# EAGLE design BPM7005_Dual_Shield_MegaWing (EAGLE 5.11)
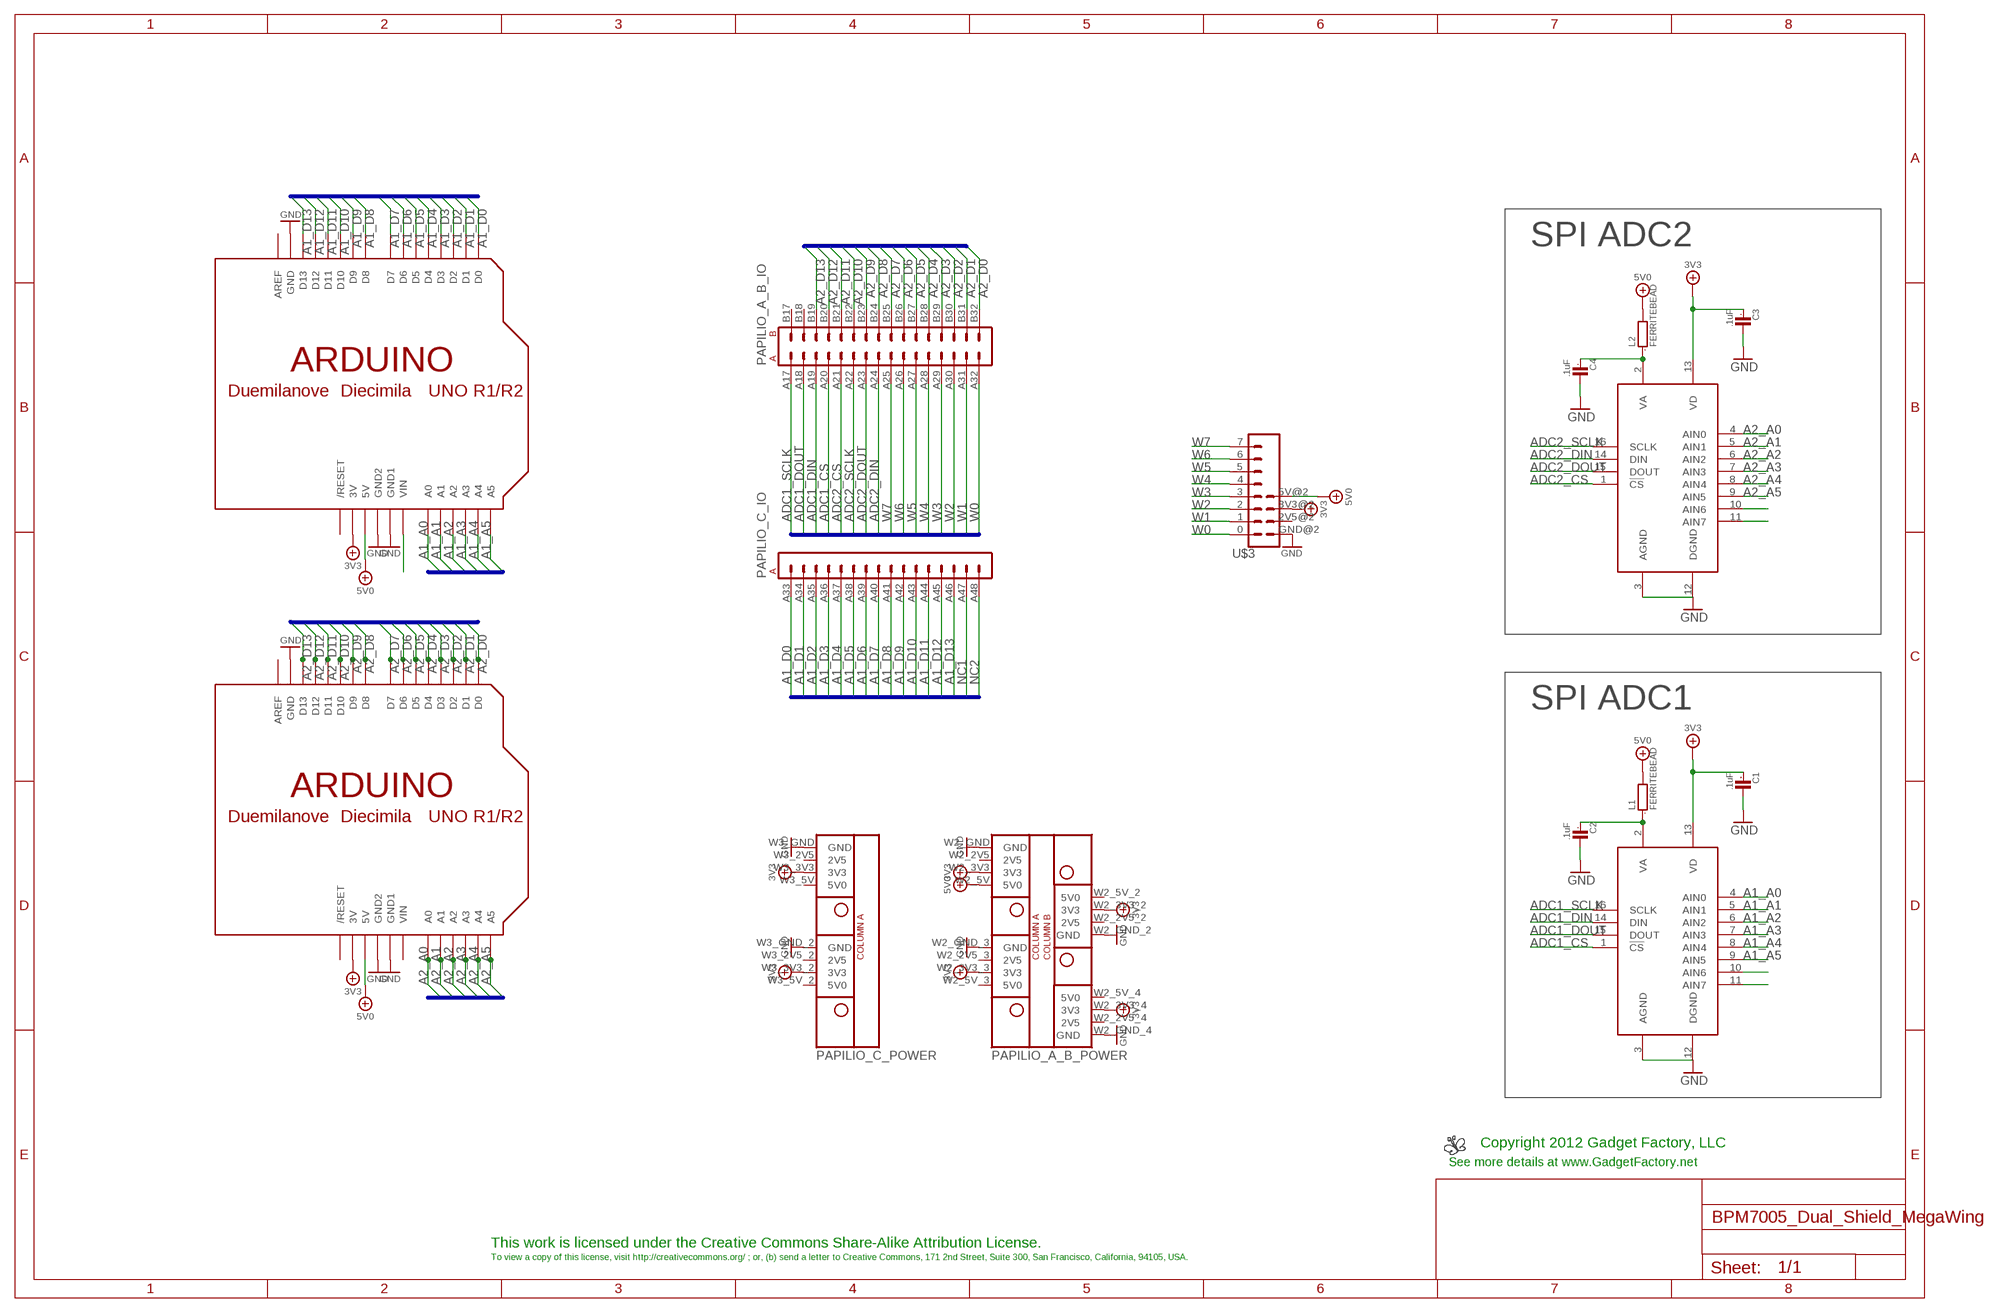
[diagram p0: schematic, sheet 1]

## Parts
ADC1  ADC088S102CIMT  [TSSOP16]
ADC2  ADC088S102CIMT  [TSSOP16]
C1  .1uF  C0603  [0603]
C2  .1uF  C0603  [0603]
C3  .1uF  C0603  [0603]
C4  .1uF  C0603  [0603]
L1  FERRITEBEAD  R0603  [0603]
L2  FERRITEBEAD  R0603  [0603]
LOGO1  BUTTERFLY_LOGO  [BUTTERFLY_LOGO]
PAPILIO_  MEGAWING_FULL_P1MEGAWING_P1  [MEGAWING_FULL_NOHOLES_P1]
U$1  ARDUINO-NOHOLE  [ARDUINO-NOHOLE]
U$2  ARDUINO-NOHOLE  [ARDUINO-NOHOLE]
U$3  WING8WING8_NOHOLES  [WINGSIDE_8BIT_NOHOLES]

## Nets
3V3: ADC1.13(VD) ADC2.13(VD) C1.1 C3.1 PAPILIO_.W2_3V3(A_B_POWER:3V3) PAPILIO_.W2_3V3_2(A_B_POWER:3V3) PAPILIO_.W2_3V3_3(A_B_POWER:3V3) PAPILIO_.W2_3V3_4(A_B_POWER:3V3) PAPILIO_.W3_3V3(C_POWER:3V3) PAPILIO_.W3_3V3_2(C_POWER:3V3) U$1.3V U$2.3V U$3.3V3@2(3V3)
5V0: L1.2 L2.2 PAPILIO_.W2_5V(A_B_POWER:5V0) U$1.5V U$2.5V U$3.5V@2(5V)
A1_A0: ADC1.4(AIN0) U$1.A0
A1_A1: ADC1.5(AIN1) U$1.A1
A1_A2: ADC1.6(AIN2) U$1.A2
A1_A3: ADC1.7(AIN3) U$1.A3
A1_A4: ADC1.8(AIN4) U$1.A4
A1_A5: ADC1.9(AIN5) U$1.A5
A1_D0: PAPILIO_.A33(C_IO:A1) U$1.D0
A1_D1: PAPILIO_.A34(C_IO:A2) U$1.D1
A1_D2: PAPILIO_.A35(C_IO:A3) U$1.D2
A1_D3: PAPILIO_.A36(C_IO:A4) U$1.D3
A1_D4: PAPILIO_.A37(C_IO:A5) U$1.D4
A1_D5: PAPILIO_.A38(C_IO:A6) U$1.D5
A1_D6: PAPILIO_.A39(C_IO:A7) U$1.D6
A1_D7: PAPILIO_.A40(C_IO:A8) U$1.D7
A1_D8: PAPILIO_.A41(C_IO:A9) U$1.D8
A1_D9: PAPILIO_.A42(C_IO:A10) U$1.D9
A1_D10: PAPILIO_.A43(C_IO:A11) U$1.D10
A1_D11: PAPILIO_.A44(C_IO:A12) U$1.D11
A1_D12: PAPILIO_.A45(C_IO:A13) U$1.D12
A1_D13: PAPILIO_.A46(C_IO:A14) U$1.D13
A2_A0: ADC2.4(AIN0) U$2.A0
A2_A1: ADC2.5(AIN1) U$2.A1
A2_A2: ADC2.6(AIN2) U$2.A2
A2_A3: ADC2.7(AIN3) U$2.A3
A2_A4: ADC2.8(AIN4) U$2.A4
A2_A5: ADC2.9(AIN5) U$2.A5
A2_D0: PAPILIO_.B32(A_B_IO:B16) U$2.D0
A2_D1: PAPILIO_.B31(A_B_IO:B15) U$2.D1
A2_D2: PAPILIO_.B30(A_B_IO:B14) U$2.D2
A2_D3: PAPILIO_.B29(A_B_IO:B13) U$2.D3
A2_D4: PAPILIO_.B28(A_B_IO:B12) U$2.D4
A2_D5: PAPILIO_.B27(A_B_IO:B11) U$2.D5
A2_D6: PAPILIO_.B26(A_B_IO:B10) U$2.D6
A2_D7: PAPILIO_.B25(A_B_IO:B9) U$2.D7
A2_D8: PAPILIO_.B24(A_B_IO:B8) U$2.D8
A2_D9: PAPILIO_.B23(A_B_IO:B7) U$2.D9
A2_D10: PAPILIO_.B22(A_B_IO:B6) U$2.D10
A2_D11: PAPILIO_.B21(A_B_IO:B5) U$2.D11
A2_D12: PAPILIO_.B20(A_B_IO:B4) U$2.D12
A2_D13: PAPILIO_.B19(A_B_IO:B3) U$2.D13
ADC1_CS: ADC1.1(!CS) PAPILIO_.A20(A_B_IO:A4)
ADC1_DIN: ADC1.14(DIN) PAPILIO_.A19(A_B_IO:A3)
ADC1_DOUT: ADC1.15(DOUT) PAPILIO_.A18(A_B_IO:A2)
ADC1_SCLK: ADC1.16(SCLK) PAPILIO_.A17(A_B_IO:A1)
ADC2_CS: ADC2.1(!CS) PAPILIO_.A21(A_B_IO:A5)
ADC2_DIN: ADC2.14(DIN) PAPILIO_.A24(A_B_IO:A8)
ADC2_DOUT: ADC2.15(DOUT) PAPILIO_.A23(A_B_IO:A7)
ADC2_SCLK: ADC2.16(SCLK) PAPILIO_.A22(A_B_IO:A6)
GND: ADC1.3(AGND) ADC1.12(DGND) ADC2.3(AGND) ADC2.12(DGND) C1.2 C2.2 C3.2 C4.2 PAPILIO_.W2_GND(A_B_POWER:GND) PAPILIO_.W2_GND_2(A_B_POWER:GND) PAPILIO_.W2_GND_3(A_B_POWER:GND) PAPILIO_.W2_GND_4(A_B_POWER:GND) PAPILIO_.W3_GND(C_POWER:GND) PAPILIO_.W3_GND_2(C_POWER:GND) U$1.GND U$1.GND1 U$1.GND2 U$2.GND U$2.GND1 U$2.GND2 U$3.GND@2(GND)
N$1: U$1.VIN
N$6: ADC2.2(VA) C4.1 L2.1
N$8: ADC2.11(AIN7)
N$9: ADC2.10(AIN6)
N$37: ADC1.2(VA) C2.1 L1.1
N$39: ADC1.11(AIN7)
N$40: ADC1.10(AIN6)
NC1: PAPILIO_.A47(C_IO:A15)
NC2: PAPILIO_.A48(C_IO:A16)
W0: PAPILIO_.A32(A_B_IO:A16) U$3.0
W1: PAPILIO_.A31(A_B_IO:A15) U$3.1
W2: PAPILIO_.A30(A_B_IO:A14) U$3.2
W3: PAPILIO_.A29(A_B_IO:A13) U$3.3
W4: PAPILIO_.A28(A_B_IO:A12) U$3.4
W5: PAPILIO_.A27(A_B_IO:A11) U$3.5
W6: PAPILIO_.A26(A_B_IO:A10) U$3.6
W7: PAPILIO_.A25(A_B_IO:A9) U$3.7
Unconnected: PAPILIO_.B17(A_B_IO:B1) PAPILIO_.B18(A_B_IO:B2) PAPILIO_.W2_2V5(A_B_POWER:2V5) PAPILIO_.W2_2V5_2(A_B_POWER:2V5) PAPILIO_.W2_2V5_3(A_B_POWER:2V5) PAPILIO_.W2_2V5_4(A_B_POWER:2V5) PAPILIO_.W2_5V_2(A_B_POWER:5V0) PAPILIO_.W2_5V_3(A_B_POWER:5V0) PAPILIO_.W2_5V_4(A_B_POWER:5V0) PAPILIO_.W3_2V5(C_POWER:2V5) PAPILIO_.W3_2V5_2(C_POWER:2V5) PAPILIO_.W3_5V(C_POWER:5V0) PAPILIO_.W3_5V_2(C_POWER:5V0) U$1.AREF U$1.RESET(/RESET) U$2.AREF U$2.RESET(/RESET) U$3.2V5@2(2V5)

## Buses
SW[0..7],LED[0..7]
RED[0..2],GREEN[0..2],BLUE[0..1],VERTICAL_SYNC,HORIZONTAL_SYNC,AUDIO,SPI_SCLK,SPI_DIN,SPI_DOUT,SPI_CS,JOY_SELECT,JOY_RIGHT,JOY_LEFT,JOY_DOWN,JOY_UP,AN[0..3],A,B,C,D,E,F,G,DP
A1_D[0..13]
A1_A[0..7]
A2_D[0..13]
A2_A[0..7]

## Notes on the sheet
- SPI ADC2
- SPI ADC1
- Copyright 2012 Gadget Factory, LLC
- See more details at www.GadgetFactory.net
- This work is licensed under the Creative Commons Share-Alike Attribution License.
- To view a copy of this license, visit http://creativecommons.org/ ; or, (b) send a letter to Creative Commons, 171 2nd Street, Suite 300, San Francisco, California, 94105, USA.

## Power pins joined to a net without a drawn wire
VIN: U$2.VIN

## Library data of the parts
ADC1 ADC2 = spiadc:ADC088S102
C1-C4 = GadgetFactory:C: CAPACITOR, European symbol
L1 L2 = GadgetFactory:R: RESISTOR, European symbol
LOGO1 = GadgetFactory_Pub:BUTTERFLY_LOGO
PAPILIO_ = Papilio:MEGAWING_FULL_P1
U$1 U$2 = adafruit:ARDUINO: Arduino Diecimila/Duemilanove Make a shield with ease, this package has all the named pins as well as the two mounting drill holes and an outline of the USB and DC power connector. The outline is on the DIMENSION layer, so if your board house uses it they will cut the outline to match. http://www.ladyada.net/library/pcb/eaglelibrary.html
U$3 = Papilio:WING8

## Board
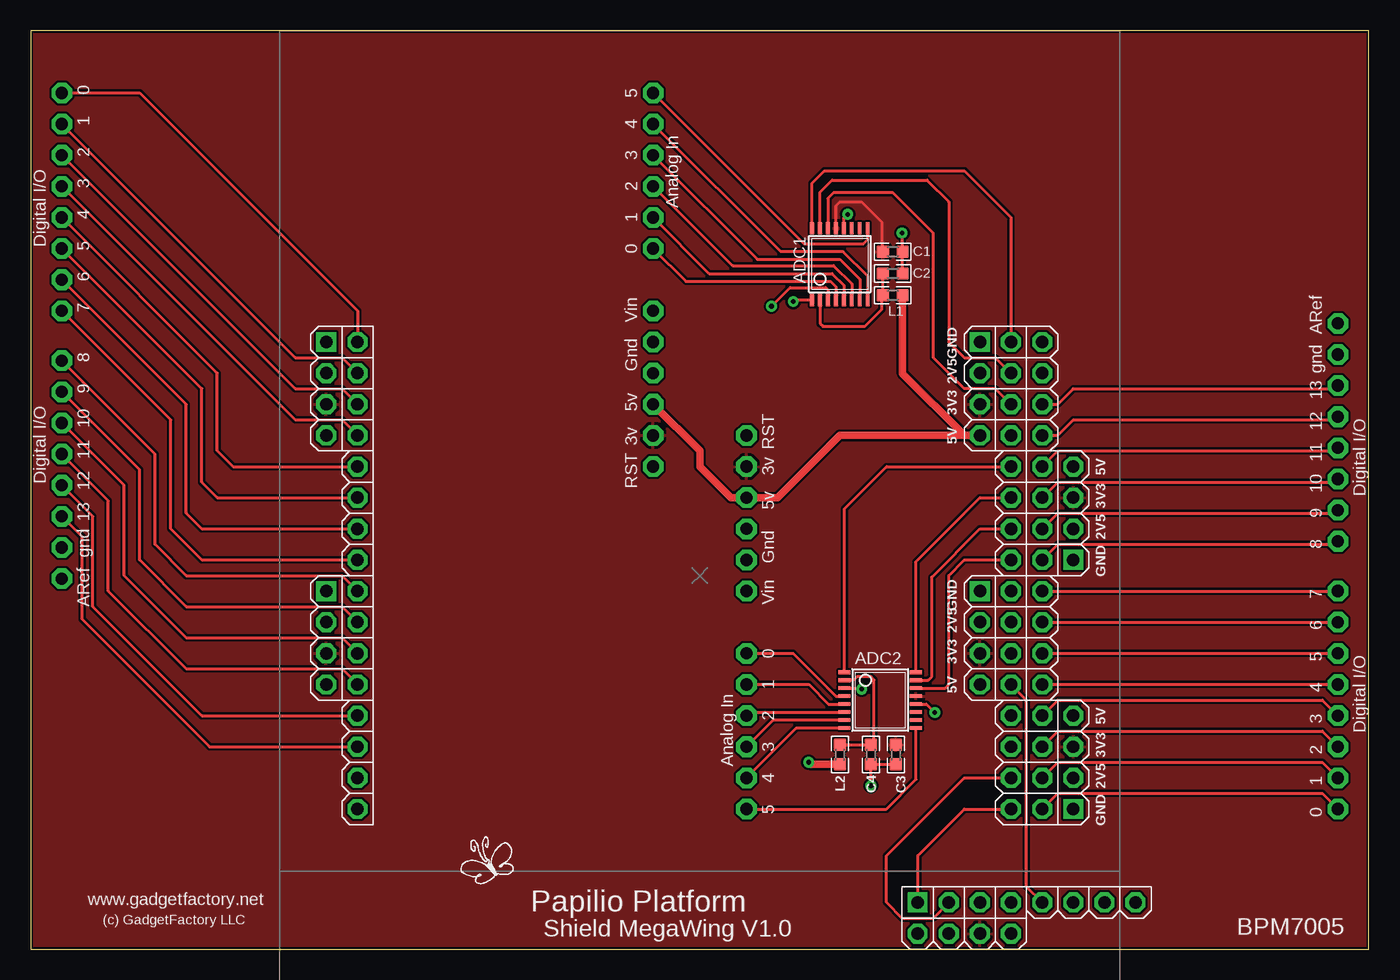
[diagram p1: board, top side]
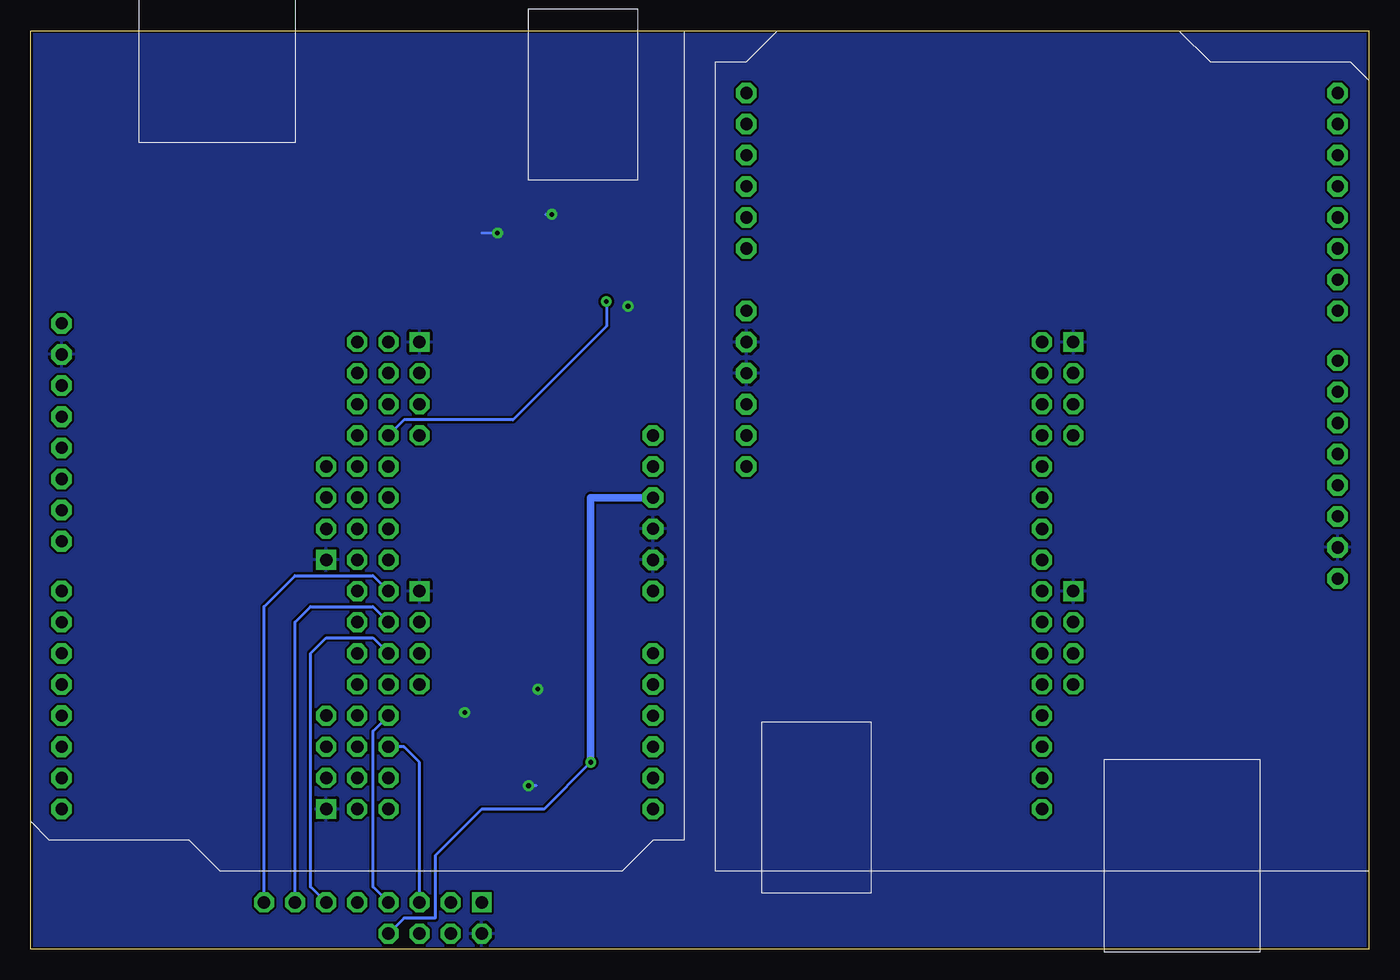
[diagram p2: board, bottom side, seen from below]

Size 109.21 x 74.93 mm. Coordinates in mm from the lower left corner, seen from the top.
Outline: 0,74.93 0,0 109.21,0 109.21,74.93 0,74.93
Copper layers (1*16): Top 0.035mm / dielectric 1.5mm / Bottom 0.035mm
Design rules "SparkFun_Derived_GoldePheonix_7mil *": minimum track width 7mil, minimum drill 15mil, track to track 7mil, track to pad 7mil, pad to pad 7mil, via to via 7mil, smd to smd 7mil, copper to edge 7mil, drill to drill 7mil, minimum pad ring 12mil, minimum via ring 10mil, stop-mask expansion 4mil, vias tented up to drill 18mil, thermal gap 10mil

### Footprints (pad centres in the part's own frame; a part is rotated, then mirrored left to right if it is on the bottom)
TSSOP16 = smd 0.305 x 0.991: 1 -2.275,-2.918; 2 -1.625,-2.918; 3 -0.975,-2.918; 4 -0.325,-2.918; 5 0.325,-2.918; 6 0.975,-2.918; 7 1.625,-2.918; 8 2.275,-2.918; 9 2.275,2.918; 10 1.625,2.918; 11 0.975,2.918; 12 0.325,2.918; 13 -0.325,2.918; 14 -0.975,2.918; 15 -1.625,2.918; 16 -2.275,2.918
0603 = smd 1 x 1: 1 -0.8,0; 2 0.8,0
MEGAWING_FULL_NOHOLES_P1 = drill 1.016 octagon: A17 59.69,43.18; A18 59.69,40.64; A19 59.69,38.1; A20 59.69,35.56; A21 59.69,33.02; A22 59.69,30.48; A23 59.69,27.94; A24 59.69,25.4; A25 59.69,22.86; A26 59.69,20.32; A27 59.69,17.78; A28 59.69,15.24; A29 59.69,12.7; A30 59.69,10.16; A31 59.69,7.62; A32 59.69,5.08; A33 6.35,43.18; A34 6.35,40.64; A35 6.35,38.1; A36 6.35,35.56; A37 6.35,33.02; A38 6.35,30.48; A39 6.35,27.94; A40 6.35,25.4; A41 6.35,22.86; A42 6.35,20.32; A43 6.35,17.78; A44 6.35,15.24; A45 6.35,12.7; A46 6.35,10.16; A47 6.35,7.62; A48 6.35,5.08; B17 62.23,43.18; B18 62.23,40.64; B19 62.23,38.1; B20 62.23,35.56; B21 62.23,33.02; B22 62.23,30.48; B23 62.23,27.94; B24 62.23,25.4; B25 62.23,22.86; B26 62.23,20.32; B27 62.23,17.78; B28 62.23,15.24; B29 62.23,12.7; B30 62.23,10.16; B31 62.23,7.62; B32 62.23,5.08; W2_2V5 57.15,40.64; W2_2V5_2 64.77,27.94; W2_2V5_3 57.15,20.32; W2_2V5_4 64.77,7.62; W2_3V3 57.15,38.1; W2_3V3_2 64.77,30.48; W2_3V3_3 57.15,17.78; W2_3V3_4 64.77,10.16; W2_5V 57.15,35.56; W2_5V_2 64.77,33.02; W2_5V_3 57.15,15.24; W2_5V_4 64.77,12.7; W3_2V5 3.81,40.64; W3_2V5_2 3.81,20.32; W3_3V3 3.81,38.1; W3_3V3_2 3.81,17.78; W3_5V 3.81,35.56; W3_5V_2 3.81,15.24 | drill 1.016 square: W2_GND 57.15,43.18; W2_GND_2 64.77,25.4; W2_GND_3 57.15,22.86; W2_GND_4 64.77,5.08; W3_GND 3.81,43.18; W3_GND_2 3.81,22.86
ARDUINO-NOHOLE = drill 1 pad 1.676 octagon: 3V 35.56,2.54; 5V 38.1,2.54; A0 50.8,2.54; A1 53.34,2.54; A2 55.88,2.54; A3 58.42,2.54; A4 60.96,2.54; A5 63.5,2.54; AREF 23.876,50.8; D0 63.5,50.8; D1 60.96,50.8; D2 58.42,50.8; D3 55.88,50.8; D4 53.34,50.8; D5 50.8,50.8; D6 48.26,50.8; D7 45.72,50.8; D8 41.656,50.8; D9 39.116,50.8; D10 36.576,50.8; D11 34.036,50.8; D12 31.496,50.8; D13 28.956,50.8; GND 26.416,50.8; GND1 43.18,2.54; GND2 40.64,2.54; RESET 33.02,2.54; VIN 45.72,2.54
WINGSIDE_8BIT_NOHOLES = drill 1.016 square: 0 19.05,1.27 | drill 1.016 octagon: 1 16.51,1.27; 2 13.97,1.27; 2V5@2 16.51,3.81; 3 11.43,1.27; 3V3@2 13.97,3.81; 4 8.89,1.27; 5 6.35,1.27; 5V@2 11.43,3.81; 6 3.81,1.27; 7 1.27,1.27; GND@2 19.05,3.81

### Placement (x,y rotation side)
ADC1  66.04,55.88 0 top
ADC2  69.34,20.32 270 top
C1  70.36,56.9 0 top
C2  70.36,55.12 0 top
C3  70.61,15.88 270 top
C4  68.58,15.88 270 top
L1  70.36,53.34 0 top
L2  66.04,15.88 270 top
LOGO1  37.34,6.73 0 top
PAPILIO_  20.32,6.35 0 top
U$1  53.34,6.35 90 top
U$2  55.88,74.93 270 top
U$3  91.44,5.08 180 top

### Tracks (layer width: path | path; a pad name or v marks a point on that pad's centre or on a via)
3V3
  Top 0.254: ADC1.13 65.72,60.63 66.04,60.96 67.82,60.96 69.47,59.31 69.47,56.98 C1.1
  pour Top: 0,74.93 0,0 109.22,0 109.22,74.93
5V0  (via drill 0.38)
  Top 0.61: L1.2 71.16,46.95 76.2,41.91 PAPILIO_.W2_5V 66.04,41.91 60.96,36.83 U$2.5V 57.15,36.83 54.61,39.37 54.61,40.64 U$1.5V | L2.2 63.66,15.07 v63.5,15.24
  Bottom 0.254: U$3.5V@2 78.74,2.54 76.2,2.54 76.2,7.62 72.39,11.43 67.31,11.43 v63.5,15.24
  Bottom 0.61: v63.5,15.24 63.5,36.83 U$2.5V
A1_A0
  Top 0.254: ADC1.4 65.72,54.05 65.28,54.48 53.47,54.48 U$1.A0
A1_A1
  Top 0.254: ADC1.5 66.36,54.16 65.41,55.12 55.37,55.12 U$1.A1
A1_A2
  Top 0.254: ADC1.6 67.02,54.27 65.53,55.75 57.28,55.75 U$1.A2
A1_A3
  Top 0.254: ADC1.7 67.67,54.64 66.04,56.26 59.31,56.26 U$1.A3
A1_A4
  Top 0.254: ADC1.8 68.31,54.88 66.29,56.9 61.21,56.9 U$1.A4
A1_A5
  Top 0.254: ADC1.9 68.31,57.9 67.94,57.53 63.12,57.53 U$1.A5
A1_D0
  Top 0.254: PAPILIO_.A33 26.67,52.07 8.89,69.85 U$1.D0
A1_D1
  Top 0.254: PAPILIO_.A34 25.4,48.26 21.59,48.26 U$1.D1
A1_D2
  Top 0.254: PAPILIO_.A35 25.4,45.72 21.59,45.72 U$1.D2
A1_D3
  Top 0.254: PAPILIO_.A36 25.4,43.18 21.59,43.18 U$1.D3
A1_D4
  Top 0.254: PAPILIO_.A37 16.51,39.37 15.24,40.64 15.24,46.99 U$1.D4
A1_D5
  Top 0.254: PAPILIO_.A38 15.24,36.83 13.97,38.1 13.97,45.72 U$1.D5
A1_D6
  Top 0.254: PAPILIO_.A39 13.97,34.29 12.7,35.56 12.7,44.45 U$1.D6
A1_D7
  Top 0.254: PAPILIO_.A40 13.97,31.75 11.43,34.29 11.43,43.18 U$1.D7
A1_D8
  Top 0.254: PAPILIO_.A41 25.4,30.48 12.7,30.48 10.16,33.02 10.16,40.39 U$1.D8
A1_D9
  Top 0.254: PAPILIO_.A42 25.4,27.94 12.7,27.94 8.89,31.75 8.89,39.12 U$1.D9
A1_D10
  Top 0.254: PAPILIO_.A43 25.4,25.4 12.7,25.4 7.62,30.48 7.62,37.85 U$1.D10
A1_D11
  Top 0.254: PAPILIO_.A44 25.4,22.86 12.7,22.86 6.35,29.21 6.35,36.58 U$1.D11
A1_D12
  Top 0.254: PAPILIO_.A45 13.97,19.05 5.08,27.94 5.08,35.31 U$1.D12
A1_D13
  Top 0.254: PAPILIO_.A46 14.61,16.51 4.19,26.92 4.19,33.66 U$1.D13
A2_A0
  Top 0.254: ADC2.4 65.72,20.64 62.23,24.13 U$2.A0
A2_A1
  Top 0.254: ADC2.5 65.09,20 63.5,21.59 U$2.A1
A2_A2
  Top 0.254: ADC2.6 58.72,19.34 U$2.A2
A2_A3
  Top 0.254: ADC2.7 60.6,18.7 U$2.A3
A2_A4
  Top 0.254: ADC2.8 62.49,18.05 U$2.A4
A2_A5
  Top 0.254: ADC2.9 72.26,13.84 69.85,11.43 U$2.A5
A2_D0
  Top 0.254: PAPILIO_.B32 83.82,12.7 105.41,12.7 U$2.D0
A2_D1
  Top 0.254: PAPILIO_.B31 83.82,15.24 105.41,15.24 U$2.D1
A2_D2
  Top 0.254: PAPILIO_.B30 83.82,17.78 105.41,17.78 U$2.D2
A2_D3
  Top 0.254: PAPILIO_.B29 83.82,20.32 105.41,20.32 U$2.D3
A2_D4
  Top 0.254: PAPILIO_.B28 U$2.D4
A2_D5
  Top 0.254: PAPILIO_.B27 U$2.D5
A2_D6
  Top 0.254: PAPILIO_.B26 U$2.D6
A2_D7
  Top 0.254: PAPILIO_.B25 U$2.D7
A2_D8
  Top 0.254: PAPILIO_.B24 83.82,33.02 106.43,33.02 U$2.D8
A2_D9
  Top 0.254: PAPILIO_.B23 83.82,35.56 106.43,35.56 U$2.D9
A2_D10
  Top 0.254: PAPILIO_.B22 83.82,38.1 106.43,38.1 U$2.D10
A2_D11
  Top 0.254: PAPILIO_.B21 83.82,40.64 106.43,40.64 U$2.D11
A2_D12
  Top 0.254: PAPILIO_.B20 83.82,41.91 85.09,43.18 106.43,43.18 U$2.D12
A2_D13
  Top 0.254: PAPILIO_.B19 83.82,44.45 85.09,45.72 106.43,45.72 U$2.D13
ADC1_CS  (via drill 0.38)
  Top 0.254: ADC1.1 62.36,52.96 v62.23,52.83
  Bottom 0.254: v62.23,52.83 62.23,50.8 69.85,43.18 78.74,43.18 PAPILIO_.A20
ADC1_DIN
  Top 0.254: ADC1.14 65.06,61.26 65.53,61.72 70.36,61.72 73.66,58.42 73.66,48.26 76.2,45.72 78.74,45.72 PAPILIO_.A19
ADC1_DOUT
  Top 0.254: ADC1.15 64.42,61.75 65.41,62.74 73.15,62.74 74.93,60.96 74.93,49.53 76.2,48.26 78.74,48.26 PAPILIO_.A18
ADC1_SCLK
  Top 0.254: ADC1.16 63.77,62.49 64.77,63.5 76.2,63.5 80.01,59.69 PAPILIO_.A17
ADC2_CS
  Top 0.254: ADC2.1 66.42,35.94 69.85,39.37 PAPILIO_.A21
ADC2_DIN
  Top 0.254: ADC2.14 74.64,21.3 74.93,21.59 74.93,30.48 76.2,31.75 PAPILIO_.A24
ADC2_DOUT
  Top 0.254: ADC2.15 73.25,21.95 73.53,22.23 73.53,30.35 77.47,34.29 PAPILIO_.A23
ADC2_SCLK
  Top 0.254: ADC2.16 72.26,31.62 77.47,36.83 PAPILIO_.A22
GND  (via drill 0.38)
  Top 0.254: v71.12,58.42 71.16,58.38 C1.2 C2.2 | ADC1.12 66.36,59.63 v66.67,59.94 | ADC1.3 65.06,53.81 64.9,53.98 61.98,53.98 v60.45,52.45 | C3.2 C4.2 v68.58,13.34 | ADC2.12 73.1,20 v73.79,19.3 | ADC2.3 67.73,21.3 v67.82,21.21
  Bottom 0.254: v71.12,58.42 72.39,58.42 | v60.45,52.45 60.07,52.45 | v66.67,59.94 67.18,59.94 | 67.94,13.34 v68.58,13.34 | v73.79,19.3 74.17,19.3 | v67.82,21.21 67.82,20.83
  pour Bottom: 0,74.93 0,0 109.22,0 109.22,74.93
N$6
  Top 0.254: L2.1 C4.1 68.83,16.93 68.83,21.97 68.58,22.23 67.44,22.23 67.16,21.95 ADC2.2
N$37
  Top 0.254: C2.1 L1.1 69.47,53.25 69.47,52.2 68.07,50.8 64.64,50.8 64.42,51.03 ADC1.2
W0
  Top 0.254: PAPILIO_.A32 76.2,11.43 72.39,7.62 U$3.0
W1
  Top 0.254: PAPILIO_.A31 76.2,13.97 69.85,7.62 69.85,3.81 71.12,2.54 73.66,2.54 U$3.1
W2
  Bottom 0.254: PAPILIO_.A30 78.74,16.51 77.47,15.24 U$3.2
W3
  Bottom 0.254: PAPILIO_.A29 81.28,17.78 81.28,5.08 U$3.3
W4
  Top 0.254: PAPILIO_.A28 81.28,20.32 81.28,5.08 U$3.4
W5
  Bottom 0.254: PAPILIO_.A27 81.28,25.4 85.09,25.4 86.36,24.13 86.36,5.08 U$3.5
W6
  Bottom 0.254: PAPILIO_.A26 81.28,27.94 86.36,27.94 87.63,26.67 U$3.6
W7
  Bottom 0.254: PAPILIO_.A25 81.28,30.48 87.63,30.48 90.17,27.94 U$3.7

### Text on the board
tPlace: www.gadgetfactory.net | Papilio Platform | (c) GadgetFactory LLC | Shield MegaWing V1.0 | BPM7005